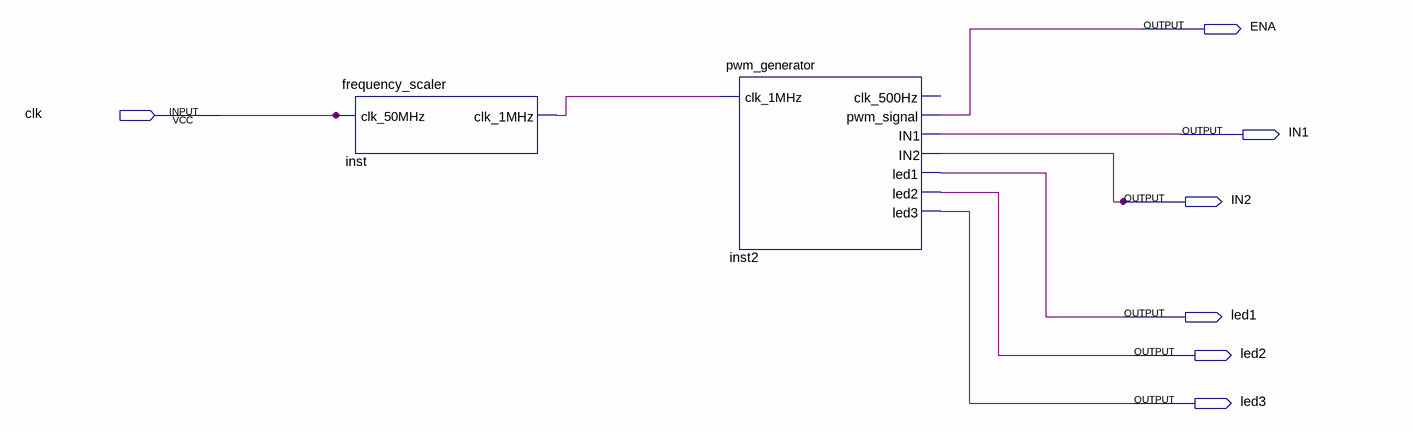
[diagram p0: schematic sheet]
// Quartus schematic Motor_Driver.bdf as structural Verilog: 2 symbols, 7 pins
module Motor_Driver (
  input  clk,
  output ENA,
  output IN1,
  output IN2,
  output led1,
  output led2,
  output led3
);

  wire inst_clk_1mhz;

  frequency_scaler inst (.clk_50MHz(clk), .clk_1MHz(inst_clk_1mhz));
  pwm_generator inst2 (
    .clk_1MHz(inst_clk_1mhz), .pwm_signal(ENA), .IN1(IN1), .IN2(IN2), .led1(led1), .led2(led2), .led3(led3));  // open: clk_500Hz
endmodule
